# EAGLE schematic DoubleBoilerPower (EAGLE 7.2.0)
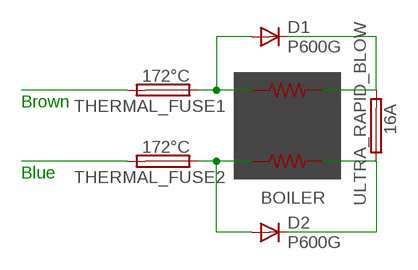
[diagram p0: schematic, sheet 1]

## Parts
100K2  R-US_0204/2V  [0204V]
BOILER  R-US_0204/2V  [0204V]
D1  P600G  1N4004  [DO41-10]
D2  P600G  1N4004  [DO41-10]
THERMAL_FUSE1  172°C  19559  [19559]
THERMAL_FUSE2  172°C  19559  [19559]
ULTRA_RAPID_BLOW  16A  19559  [19559]

## Nets
N$1: BOILER.2 D1.C ULTRA_RAPID_BLOW.2
N$2: 100K2.2 D2.C ULTRA_RAPID_BLOW.1
N$3: BOILER.1 D1.A THERMAL_FUSE1.1
N$4: 100K2.1 D2.A THERMAL_FUSE2.1
N$5: THERMAL_FUSE1.2
N$6: THERMAL_FUSE2.2

## Notes on the sheet
- Brown
- Blue

## Library data of the parts
100K2 BOILER = rcl:R-US_: RESISTOR, American symbol
D1 D2 = adafruit:1N4004: DIODE General purpose 1N400x type rectifier (With bigger pads) http://www.ladyada.net/library/pcb/eaglelibrary.html
THERMAL_FUSE1 THERMAL_FUSE2 ULTRA_RAPID_BLOW = fuse:19559: FUSE HOLDER TR5, Wickmann; MPN: 55900000001; OC_FARNELL: 9516360; OC_NEWARK: 02P0286